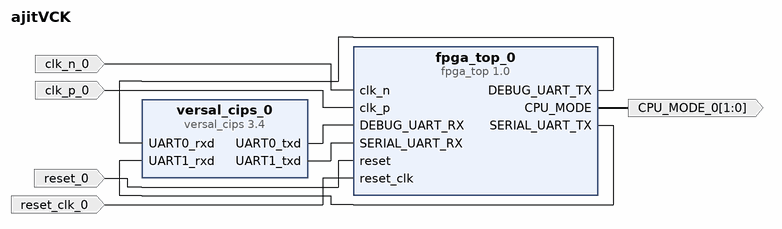
[diagram p0: block diagram of the top level]
# Vivado block design ajitVCK, xcvc1902-vsva2197-2MP-e-S, Vivado 2023.2
create_bd_design ajitVCK

create_bd_port -dir I -type rst reset_0
create_bd_port -dir I -type rst reset_clk_0
create_bd_port -dir O -from 1 -to 0 CPU_MODE_0
create_bd_port -dir I -type clk clk_p_0
set_property -dict {CONFIG.FREQ_HZ 99999001} [get_bd_ports clk_p_0]
create_bd_port -dir I -type clk clk_n_0
set_property -dict {CONFIG.FREQ_HZ 99999001} [get_bd_ports clk_n_0]

create_bd_cell -type ip -vlnv NinePath:NY:fpga_top:1.0 fpga_top_0
create_bd_cell -type ip -vlnv xilinx.com:ip:versal_cips:3.4 versal_cips_0
set_property -dict [list \
  CONFIG.IO_CONFIG_MODE Custom \
  CONFIG.PS_PMC_CONFIG {['IO_CONFIG_MODE Custom', 'PMC_I2CPMC_PERIPHERAL {{ENABLE 1} {IO {PMC_MIO 2 .. 3}}}', 'PS_I2C0_PERIPHERAL {{ENABLE 1} {IO {PS_MIO 2 .. 3}}}', 'PS_I2C1_PERIPHERAL {{ENABLE 1} {IO {PS_MIO 0 .. 1}}}', 'PS_UART0_PERIPHERAL {{ENABLE 1} {IO EMIO}}', 'PS_UART1_PERIPHERAL {{ENABLE 1} {IO EMIO}}', 'SMON_ALARMS Set_Alarms_On', 'SMON_ENABLE_TEMP_AVERAGING 0', 'SMON_TEMP_AVERAGING_SAMPLES 0']} \
] [get_bd_cells versal_cips_0]

# ---- connections ----

connect_bd_net -net clk_n_0_1 [get_bd_ports clk_n_0] [get_bd_pins fpga_top_0/clk_n]
connect_bd_net -net clk_p_0_1 [get_bd_ports clk_p_0] [get_bd_pins fpga_top_0/clk_p]
connect_bd_net [get_bd_pins fpga_top_0/CPU_MODE] [get_bd_ports CPU_MODE_0]
connect_bd_net [get_bd_pins fpga_top_0/DEBUG_UART_TX] [get_bd_pins versal_cips_0/UART0_rxd]
connect_bd_net [get_bd_pins fpga_top_0/SERIAL_UART_TX] [get_bd_pins versal_cips_0/UART1_rxd]
connect_bd_net -net reset_0_1 [get_bd_ports reset_0] [get_bd_pins fpga_top_0/reset]
connect_bd_net -net reset_clk_0_1 [get_bd_ports reset_clk_0] [get_bd_pins fpga_top_0/reset_clk]
connect_bd_net [get_bd_pins versal_cips_0/UART0_txd] [get_bd_pins fpga_top_0/DEBUG_UART_RX]
connect_bd_net [get_bd_pins versal_cips_0/UART1_txd] [get_bd_pins fpga_top_0/SERIAL_UART_RX]

validate_bd_design
save_bd_design
